# Altium schematic sheet v1_power.SCHDOC
size A4
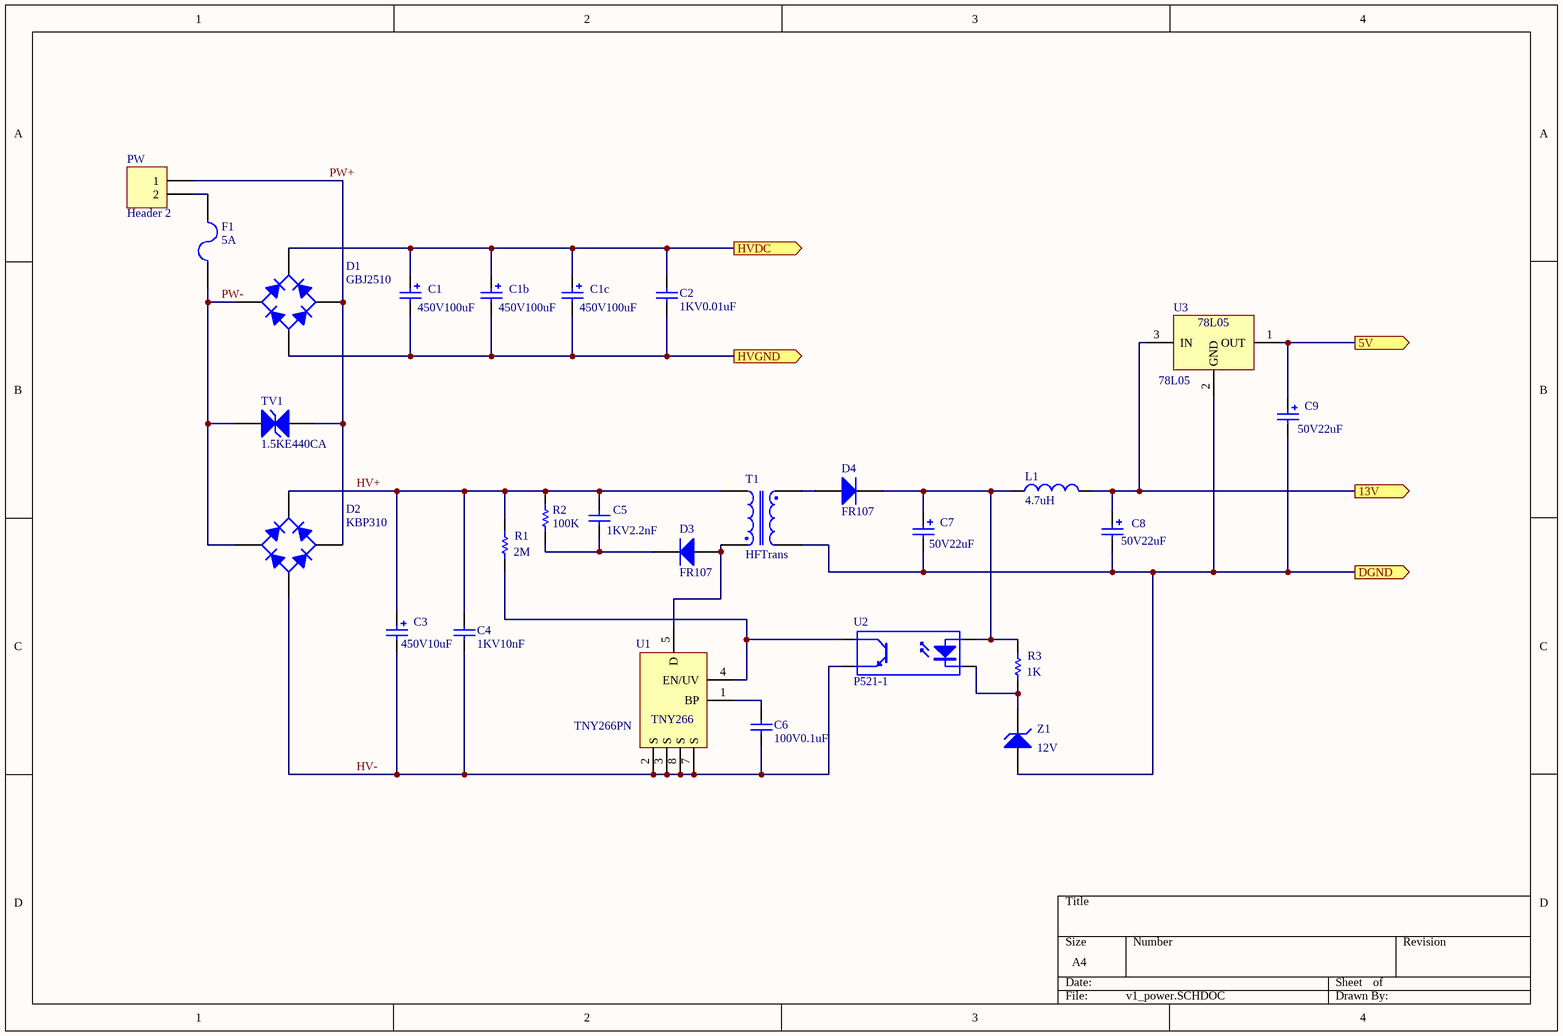
[diagram p0: v1_power.SCHDOC]

## Parts
C1  450V100uF  [CAP_18x30]
C1b  450V100uF  [CAP_18x30]
C1c  450V100uF  [CAP_10mm_stub]
C2  1KV0.01uF  [CAP7]
C3  450V10uF  [CAP2]
C4  1KV10nF  [CAP7]
C5  1KV2.2nF  [CAP5]
C6  100V0.1uF  [CAP6]
C7  50V22uF  [CAP3]
C8  50V22uF  [CAP3]
C9  50V22uF  [CAP3]
D1  GBJ2510  [GBJ2510]
D2  KBP310  [KBP310]
D3  FR107  [DIO1]
D4  FR107  [DIO1]
F1  5A  [FUSE]
L1  4.7uH  [INDUCTOR]
PW  Header 2  [Terminal2_1]
R1  2M  [RES0.25W]
R2  100K  [RES0.25W]
R3  1K  [RES0.25W]
T1  HFTrans  [EE16]
TV1  1.5KE440CA  [TVS1]
U1  TNY266PN  [TNY266PN]
U2  P521-1  [DIP-4]
U3  78L05  [TO-92D]
Z1  12V  [DIO2]

## Ports
5V, 13V, DGND, HVDC, HVGND

## Nets
5V: C9.1 U3.1(OUT) ; port 5V
13V: C8.1 L1.2 U3.3(IN) ; port 13V
DGND: C7.2 C8.2 C9.2 T1.5 U3.2(GND) Z1.1(A) ; port DGND
HV+: C3.1 C4.1 C5.2 D2.1(K) R1.2 R2.2 T1.1
HV-: C3.2 C4.2 C6.1 D2.4(A) U1.2(S) U1.3(S) U1.7(S) U1.8(S) U2.3(E)
HVDC: C1.1 C1b.1 C1c.1 C2.1 D1.1(K) ; port HVDC
HVGND: C1.2 C1b.2 C1c.2 C2.2 D1.4(A) ; port HVGND
PW+: D1.2(C) D2.2(C) PW.1 TV1.2(K)
PW-: D1.3(C) D2.3(C) F1.2 TV1.1(A)
NetC5_1: C5.1 D3.2(K) R2.1
NetC6_2: C6.2 U1.1(BP)
NetC7_1: C7.1 D4.2(K) L1.1 R3.2 U2.1(A)
NetD3_1: D3.1(A) T1.4 U1.5(D)
NetD4_1: D4.1(A) T1.8
NetF1_1: F1.1 PW.2
NetR1_1: R1.1 U1.4(EN/UV) U2.4(C)
NetR3_1: R3.1 U2.2(K) Z1.2(K)

## Notes on the sheet
- (in symbol TNY266PN) TNY266

## Library data of the parts
C1 C1b C1c C3 C7-C9 = Cap Pol2: Polarized Capacitor (Axial); Published: 8-Jun-2000; LatestRevisionDate: 17-Jul-2002; LatestRevisionNote: Re-released for DXP Platform.; Publisher: Altium Limited
C2 C4-C6 = Cap: Capacitor; Published: 8-Jun-2000; LatestRevisionDate: 17-Jul-2002; LatestRevisionNote: Re-released for DXP Platform.; Publisher: Altium Limited
D1 = GBJ2510: Single Phase Rectifier Bridge; Published: 8-Jun-2000; LatestRevisionDate: 17-Jul-2002; LatestRevisionNote: Re-released for DXP Platform.; DatasheetDocument: E2753A; PackageReference: D-44; Publisher: Altium Limited; ComponentLink1Description: Manufacturer Link; ComponentLink1URL: http://www.irf.com/
D2 = KBP310: Single Phase Rectifier Bridge; Published: 8-Jun-2000; LatestRevisionDate: 17-Jul-2002; LatestRevisionNote: Re-released for DXP Platform.; DatasheetDocument: E2753A; PackageReference: D-44; Publisher: Altium Limited; ComponentLink1Description: Manufacturer Link; ComponentLink1URL: http://www.irf.com/
D3 D4 = Diode: 1 Amp Fast Recovery Rectifier; Published: 8-Jun-2000; LatestRevisionDate: 17-Jul-2002; LatestRevisionNote: Re-released for DXP Platform.; PackageReference: DO-41; Publisher: Altium Limited; Code_JEDEC: DO-204-AL; DatasheetDocument: 1999; PackageDocument: Aug-1999; ComponentLink1Description: Manufacturer Link; ComponentLink1URL: http://www.fairchildsemi.com/
F1 = Fuse 2: Fuse; Published: 8-Jun-2000; LatestRevisionDate: 17-Jul-2002; LatestRevisionNote: Re-released for DXP Platform.; Publisher: Altium Limited
L1 = Inductor: Code_IEC: 1005; Published: 8-Jun-2000; LatestRevisionDate: 17-Jul-2002; LatestRevisionNote: Re-released for DXP Platform.; PackageReference: 0402-A; Publisher: Altium Limited; Code_JEITA: 0402
PW = Header 2: Header, 2-Pin; LatestRevisionDate: 17-Jul-2002; LatestRevisionNote: Re-released for DXP Platform.; Publisher: Altium Limited
R1-R3 = Res1: Resistor; Published: 8-Jun-2000; LatestRevisionDate: 17-Jul-2002; LatestRevisionNote: Re-released for DXP Platform.; Publisher: Altium Limited
T1 = HFTrans: Transformer; Published: 24-Mar-1999; LatestRevisionDate: 17-Jul-2002; LatestRevisionNote: Re-released for DXP Platform.; Publisher: Altium Limited
TV1 = TVS: TVS Diode; Published: 8-Jun-2000; LatestRevisionDate: 17-Jul-2002; LatestRevisionNote: Re-released for DXP Platform.; Publisher: Altium Limited
U1 = TNY266PN: PI TinySwitch II
U2 = Optoisolator1: 4-Pin Phototransistor Optocoupler; Published: 24-Mar-1999; LatestRevisionDate: 4-Mar-2005; LatestRevisionNote: Sch pins 3 & 4 Swapped.; DatasheetDocument: Nov-2003; PackageReference: DIP-4; Publisher: Altium Limited
U3 = 78L05: Positive Voltage Regulator; Published: 24-Aug-2001; LatestRevisionDate: 6-Jun-2005; LatestRevisionNote: PCB pads lengthened.; DatasheetDocument: Apr-1994; PackageDocument: Jun-2004; PackageReference: TO-252; Publisher: Altium Limited; ComponentLink1Description: Manufacturer Link; ComponentLink1URL: http://www.st.com/
Z1 = D Zener: Zener Diode; Published: 8-Jun-2000; LatestRevisionDate: 17-Jul-2002; LatestRevisionNote: Re-released for DXP Platform.; Publisher: Altium Limited